# EasyEDA schematic SCH_LMH0397_Breakout_2024-11-17.json
TITLE: Sheet_1; REV: 1.0; Date: 2023-12-11; Sheet: 1/1; Drawn By: TheStaticTurtle; Company: Your Company
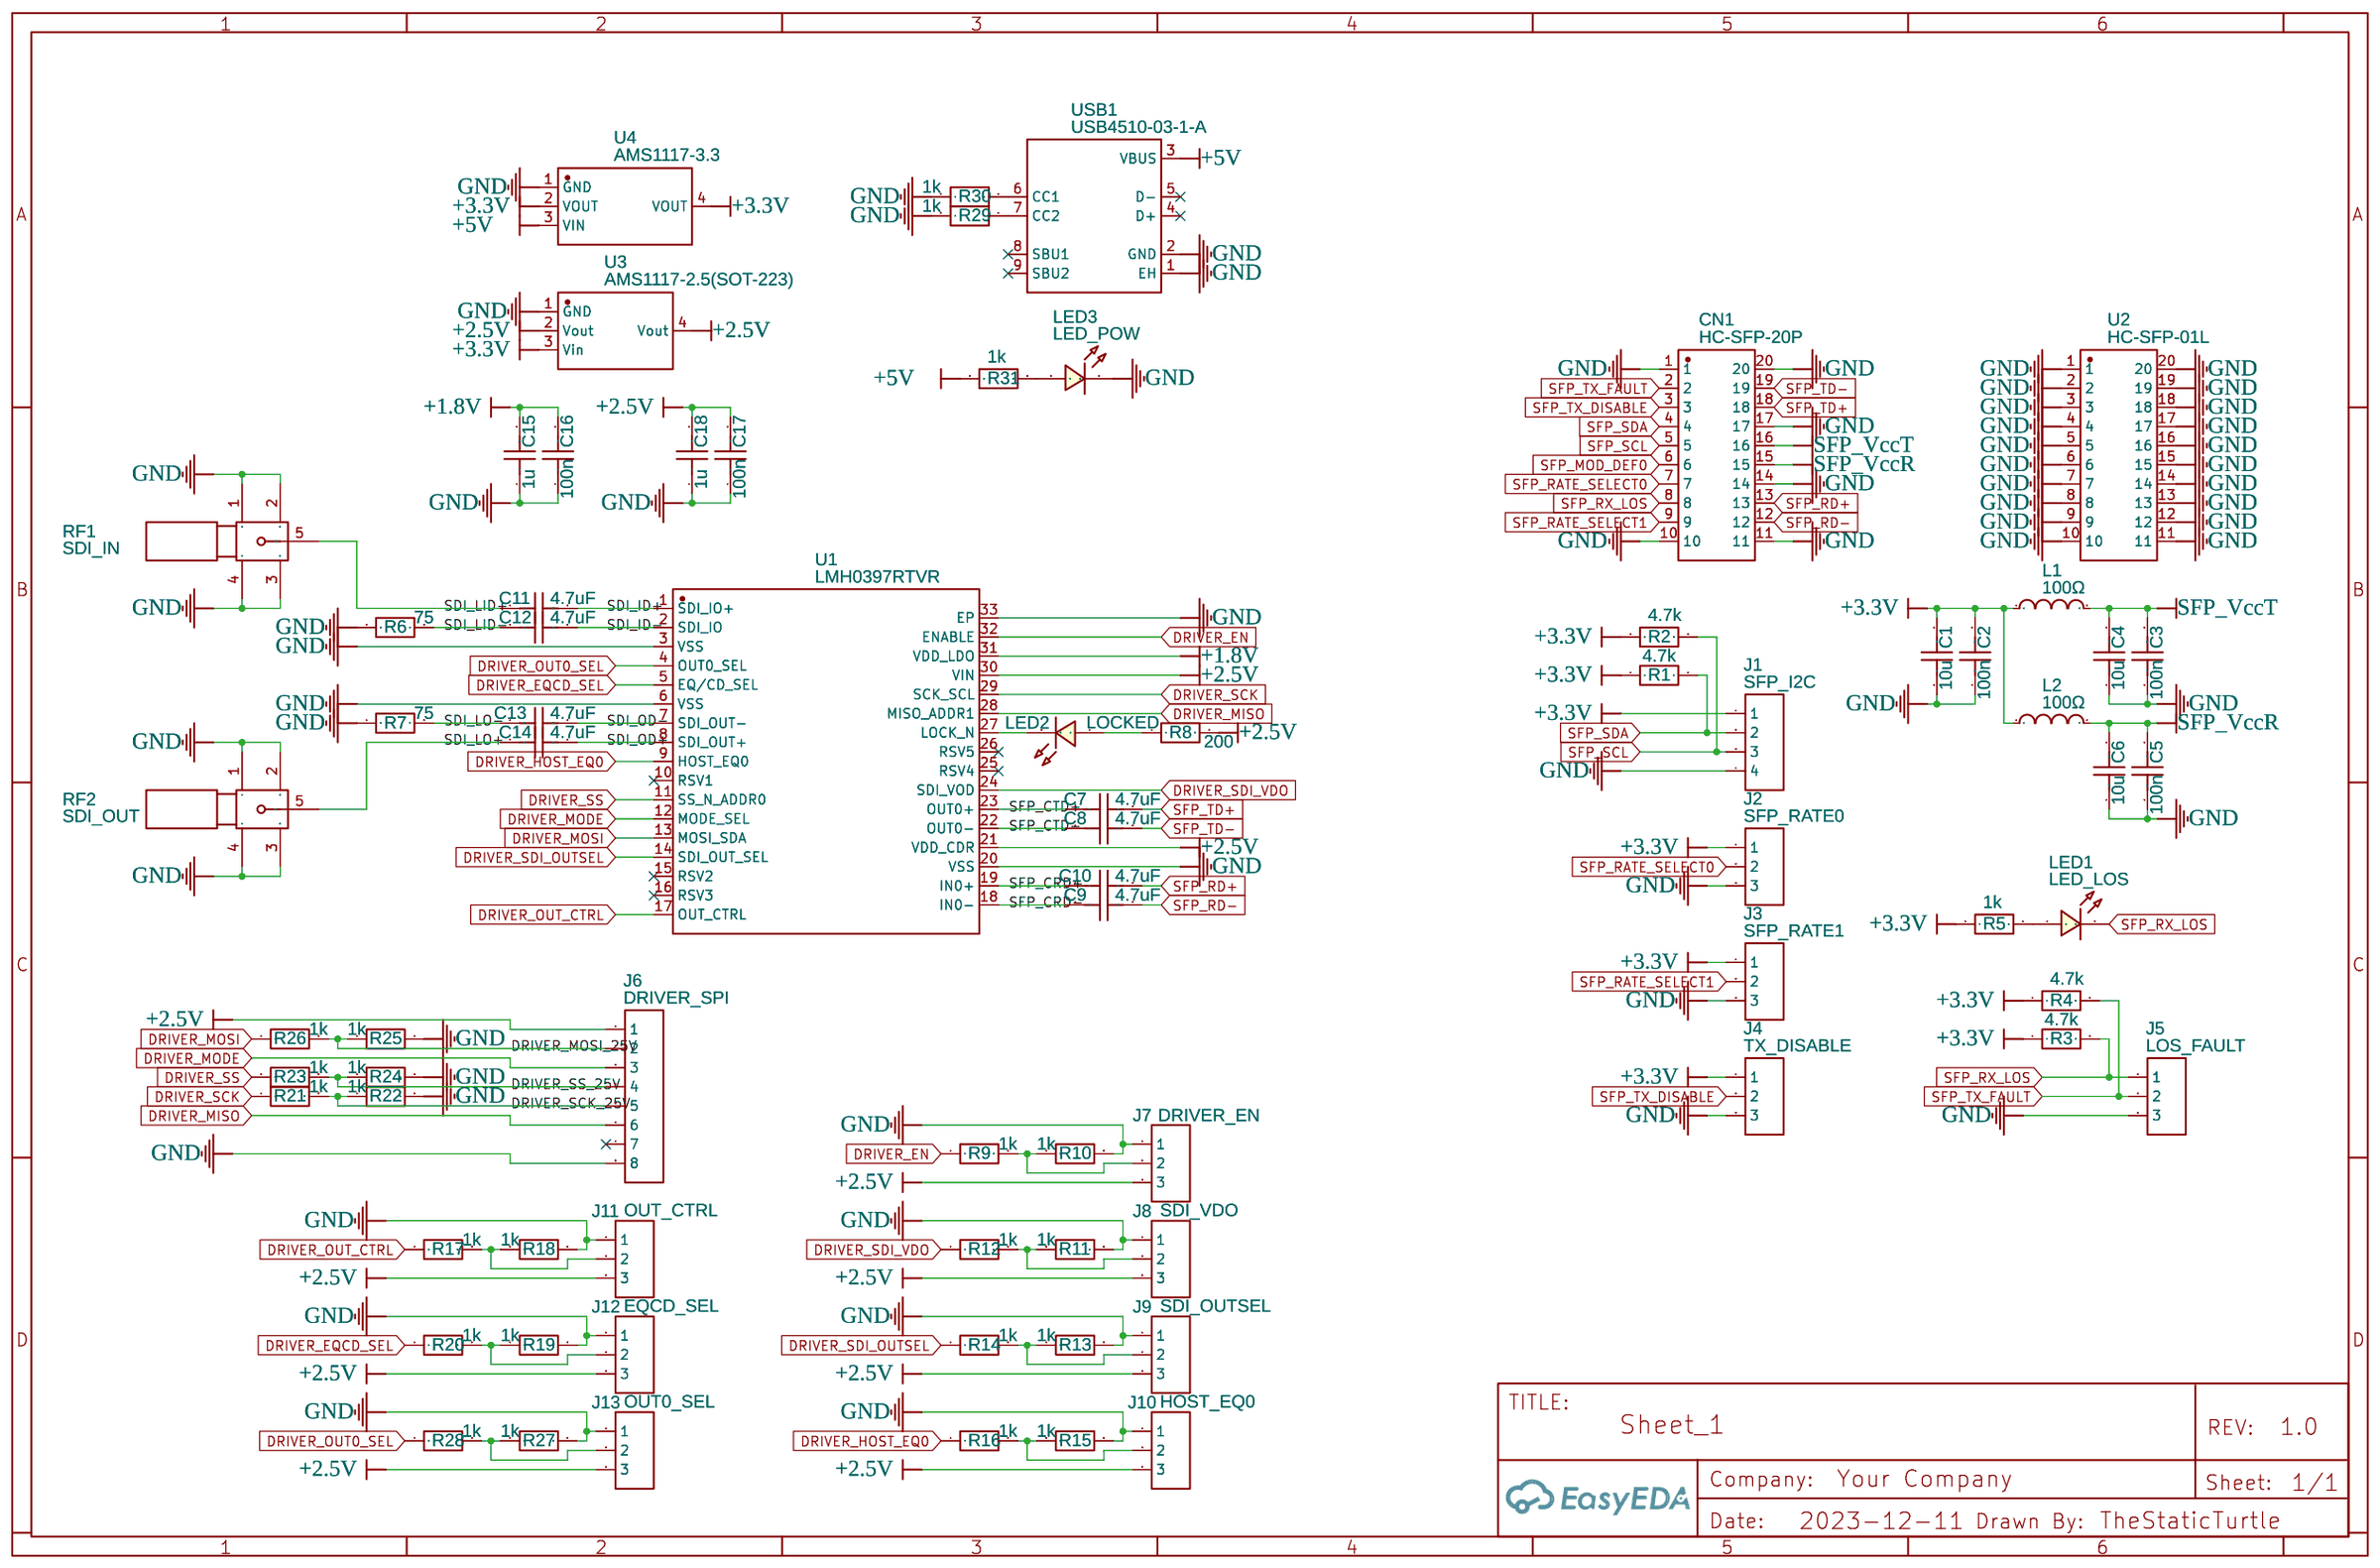
[diagram p0: schematic sheet]

## Parts
C1  10u  [C0603]
C2  100n  [C0603]
C3  100n  [C0603]
C4  10u  [C0603]
C5  100n  [C0603]
C6  10u  [C0603]
C7  4.7uF  [C0603]
C8  4.7uF  [C0603]
C9  4.7uF  [C0603]
C10  4.7uF  [C0603]
C11  4.7uF  [C0603]
C12  4.7uF  [C0603]
C13  4.7uF  [C0603]
C14  4.7uF  [C0603]
C15  1u  [C0603]
C16  100n  [C0603]
C17  100n  [C0603]
C18  1u  [C0603]
CN1  HC-SFP-20P  [CONN-SMD_20P-P0.80_HCTL_HC-SFP-20P]
J1  SFP_I2C  [HDR-M-2.54_1X4]
J2  SFP_RATE0  [HDR-M-2.54_1X3]
J3  SFP_RATE1  [HDR-M-2.54_1X3]
J4  TX_DISABLE  [HDR-M-2.54_1X3]
J5  LOS_FAULT  [HDR-M-2.54_1X3]
J6  DRIVER_SPI  [HDR-M-2.54_1X8]
J7  DRIVER_EN  [HDR-M-2.54_1X3]
J8  SDI_VDO  [HDR-M-2.54_1X3]
J9  SDI_OUTSEL  [HDR-M-2.54_1X3]
J10  HOST_EQ0  [HDR-M-2.54_1X3]
J11  OUT_CTRL  [HDR-M-2.54_1X3]
J12  EQCD_SEL  [HDR-M-2.54_1X3]
J13  OUT0_SEL  [HDR-M-2.54_1X3]
L1  100Ω  [L0805]
L2  100Ω  [L0805]
LED1  LED_LOS  [LED0603_RED]
LED2  LOCKED  [LED0603_GREEN]
LED3  LED_POW  [LED0603_RED]
R1  4.7k  [R0603]
R2  4.7k  [R0603]
R3  4.7k  [R0603]
R4  4.7k  [R0603]
R5  1k  [R0603]
R6  75  [R0603]
R7  75  [R0603]
R8  200  [R0603]
R9  1k  [R0603]
R10  1k  [R0603]
R11  1k  [R0603]
R12  1k  [R0603]
R13  1k  [R0603]
R14  1k  [R0603]
R15  1k  [R0603]
R16  1k  [R0603]
R17  1k  [R0603]
R18  1k  [R0603]
R19  1k  [R0603]
R20  1k  [R0603]
R21  1k  [R0603]
R22  1k  [R0603]
R23  1k  [R0603]
R24  1k  [R0603]
R25  1k  [R0603]
R26  1k  [R0603]
R27  1k  [R0603]
R28  1k  [R0603]
R29  1k  [R0805]
R30  1k  [R0805]
R31  1k  [R0603]
RF1  SDI_IN  [SMA-SMD_BWSMA-KE-P001]
RF2  SDI_OUT  [SMA-SMD_BWSMA-KE-P001]
U1  LMH0397RTVR  [QFN-32_L5.0-W5.0-P0.50-TL-EP3.5-1]
U2  HC-SFP-01L  [TH_HC-SFP-01L]
U3  AMS1117-2.5(SOT-223)  [SOT-223-4_L6.5-W3.5-P2.30-LS7.0-BR]
U4  AMS1117-3.3  [SOT-223-3_L6.5-W3.4-P2.30-LS7.0-BR]
USB1  USB4510-03-1-A  [USB4510-03-1-A]

## Library data of the parts
C1-C18 = C_0603_US: Contributor: LCEDA_Lib
CN1 = HC-SFP-20P: Contributor: LCSC; Supplier: LCSC; Supplier Part: C2897291; Manufacturer: HCTL(华灿天禄); JLCPCB Part Class: Extended Part
J1 = HDR-M-2.54_1x4: Supplier Part: C124378; Supplier: LCSC; Contributor: LCEDA_Lib
J2-J5 J7-J13 = HDR-M-2.54_1x3: Supplier Part: C180248; Supplier: LCSC; Contributor: LCEDA_Lib
J6 = HDR-M-2.54_1x8: Supplier Part: C190820; Supplier: LCSC; Contributor: LCEDA_Lib
L1 L2 = GZ2012D101TF: Supplier: LCSC; Manufacturer: Sunlord(顺络); Supplier Part: C1015; JLCPCB Part Class: Basic Part
LED1 LED3 = LED-0603_R: Manufacturer: EVERLIGHT(台湾亿光); Manufacturer Part: 19-217/R6C-AL1M2VY/3T; Supplier Part: C72044; Supplier: LCSC; Contributor: LCEDA_01
LED2 = LED-0603_G: Manufacturer: EVERLIGHT(台湾亿光); Manufacturer Part: 19-217/GHC-YR1S2/3T; Supplier Part: C72043; Supplier: LCSC; Contributor: LCEDA_Lib
R1-R28 R31 = R_0603_EU: Contributor: LCEDA_Lib
R29 R30 = R_0805_EU: Contributor: LCEDA_Lib
RF1 RF2 = BWSMA-KE-P001: Supplier: LCSC; Supplier Part: C496550; Manufacturer: BAT WIRELESS; Contributor: ytahn23
U1 = LMH0397RTVR: Contributor: LCSC; Supplier: LCSC; Supplier Part: C2652750; Manufacturer: TI(德州仪器); JLCPCB Part Class: Extended Part
U2 = HC-SFP-01L: Contributor: LCSC; Supplier: LCSC; Supplier Part: C2897292; Manufacturer: HCTL(华灿天禄); JLCPCB Part Class: Extended Part
U3 = AMS1117-2.5(SOT-223): Contributor: lcsc; Supplier: LCSC; Supplier Part: C5346134; Manufacturer: HXY MOSFET(华轩阳电子); JLCPCB Part Class: Extended Part
U4 = AMS1117-3.3: sourceId: dwIGgezVh; Supplier: LCSC; Manufacturer: AMS; Supplier Part: C6186; JLCPCB Part Class: Basic Part
USB1 = USB4510-03-1-A: Manufacturer: GCT; Supplier: Mouser; Supplier Part: 640-USB4510031A; link: https://www.mouser.ch/ProductDetail/GCT/USB4510-03-1-A?qs=7D1LtPJG0i3iod3O3OZ7LA%3D%3D; Contributor: Losli

## Nets
+1.8V: C15.2 C16.2 U1.31(VDD_LDO)
+2.5V: C17.2 C18.2 J6.1 J7.3 J8.3 J9.3 J10.3 J11.3 J12.3 J13.3 R8.2 U1.21(VDD_CDR) U1.30(VIN) U3.2(Vout) U3.4(Vout)
+3.3V: C1.2 C2.2 J1.1 J2.1 J3.1 J4.1 L1.1 L2.1 R1.1 R2.1 R3.1 R4.1 R5.1 U3.3(Vin) U4.2(VOUT) U4.4(VOUT)
+5V: R31.1 U4.3(VIN) USB1.3(VBUS)
GND: C1.1 C2.1 C3.1 C4.1 C5.1 C6.1 C15.1 C16.1 C17.1 C18.1 CN1.1 CN1.10 CN1.11 CN1.14 CN1.17 CN1.20 J1.4 J2.3 J3.3 J4.3 J5.3 J6.8 J7.1 J8.1 J9.1 J10.1 J11.1 J12.1 J13.1 LED3.2 R6.1 R7.1 R10.2 R11.2 R13.2 R15.2 R18.2 R19.2 R22.2 R24.2 R25.2 R27.2 R29.1 R30.1 RF1.1 RF1.2 RF1.3 RF1.4 RF2.1 RF2.2 RF2.3 RF2.4 U1.3(VSS) U1.6(VSS) U1.20(VSS) U1.33(EP) U2.1 U2.2 U2.3 U2.4 U2.5 U2.6 U2.7 U2.8 U2.9 U2.10 U2.11 U2.12 U2.13 U2.14 U2.15 U2.16 U2.17 U2.18 U2.19 U2.20 U3.1(GND) U4.1(GND) USB1.1(EH) USB1.2(GND)
DRIVER_EN: R9.1 U1.32(ENABLE)
DRIVER_EQCD_SEL: R20.1 U1.5(EQ/CD_SEL)
DRIVER_HOST_EQ0: R16.1 U1.9(HOST_EQ0)
DRIVER_MISO: J6.6 U1.28(MISO_ADDR1)
DRIVER_MODE: J6.3 U1.12(MODE_SEL)
DRIVER_MOSI: R26.1 U1.13(MOSI_SDA)
DRIVER_MOSI_25V: J6.2 R25.1 R26.2
DRIVER_OUT0_SEL: R28.1 U1.4(OUT0_SEL)
DRIVER_OUT_CTRL: R17.1 U1.17(OUT_CTRL)
DRIVER_SCK: R21.1 U1.29(SCK_SCL)
DRIVER_SCK_25V: J6.5 R21.2 R22.1
DRIVER_SDI_OUTSEL: R14.1 U1.14(SDI_OUT_SEL)
DRIVER_SDI_VDO: R12.1 U1.24(SDI_VOD)
DRIVER_SS: R23.1 U1.11(SS_N_ADDR0)
DRIVER_SS_25V: J6.4 R23.2 R24.1
SDI_ID+: C11.2 U1.1(SDI_IO+)
SDI_ID-: C12.2 U1.2(SDI_IO)
SDI_LID+: C11.1 RF1.5
SDI_LID-: C12.1 R6.2
SDI_LO+: C14.1 RF2.5
SDI_LO-: C13.1 R7.2
SDI_OD+: C14.2 U1.8(SDI_OUT+)
SDI_OD-: C13.2 U1.7(SDI_OUT-)
SFP_CRD+: C10.1 U1.19(IN0+)
SFP_CRD-: C9.1 U1.18(IN0-)
SFP_CTD+: C7.1 U1.23(OUT0+)
SFP_CTD-: C8.1 U1.22(OUT0-)
SFP_MOD_DEF0: CN1.6
SFP_RATE_SELECT0: CN1.7 J2.2
SFP_RATE_SELECT1: CN1.9 J3.2
SFP_RD+: C10.2 CN1.13
SFP_RD-: C9.2 CN1.12
SFP_RX_LOS: CN1.8 J5.1 LED1.2 R3.2
SFP_SCL: CN1.5 J1.3 R2.2
SFP_SDA: CN1.4 J1.2 R1.2
SFP_TD+: C7.2 CN1.18
SFP_TD-: C8.2 CN1.19
SFP_TX_DISABLE: CN1.3 J4.2
SFP_TX_FAULT: CN1.2 J5.2 R4.2
SFP_VccR: C5.2 C6.2 CN1.15 L2.2
SFP_VccT: C3.2 C4.2 CN1.16 L1.2
Net-(J7-2): J7.2 R9.2 R10.1
Net-(J8-2): J8.2 R11.1 R12.2
Net-(J9-2): J9.2 R13.1 R14.2
Net-(J10-2): J10.2 R15.1 R16.2
Net-(J11-2): J11.2 R17.2 R18.1
Net-(J12-2): J12.2 R19.1 R20.2
Net-(J13-2): J13.2 R27.1 R28.2
Net-(LED1-1): LED1.1 R5.2
Net-(LED2-1): LED2.1 R8.1
Net-(LED2-2): LED2.2 U1.27(LOCK_N)
Net-(LED3-1): LED3.1 R31.2
Net-(R29-2): R29.2 USB1.7(CC2)
Net-(R30-2): R30.2 USB1.6(CC1)

Not connected (* = marked no-connect by the designer): J6 7*; U1 10(RSV1)* 15(RSV2)* 16(RSV3)* 25(RSV4)* 26(RSV5)*; USB1 4(D+)* 5(D-)* 8(SBU1)* 9(SBU2)*
